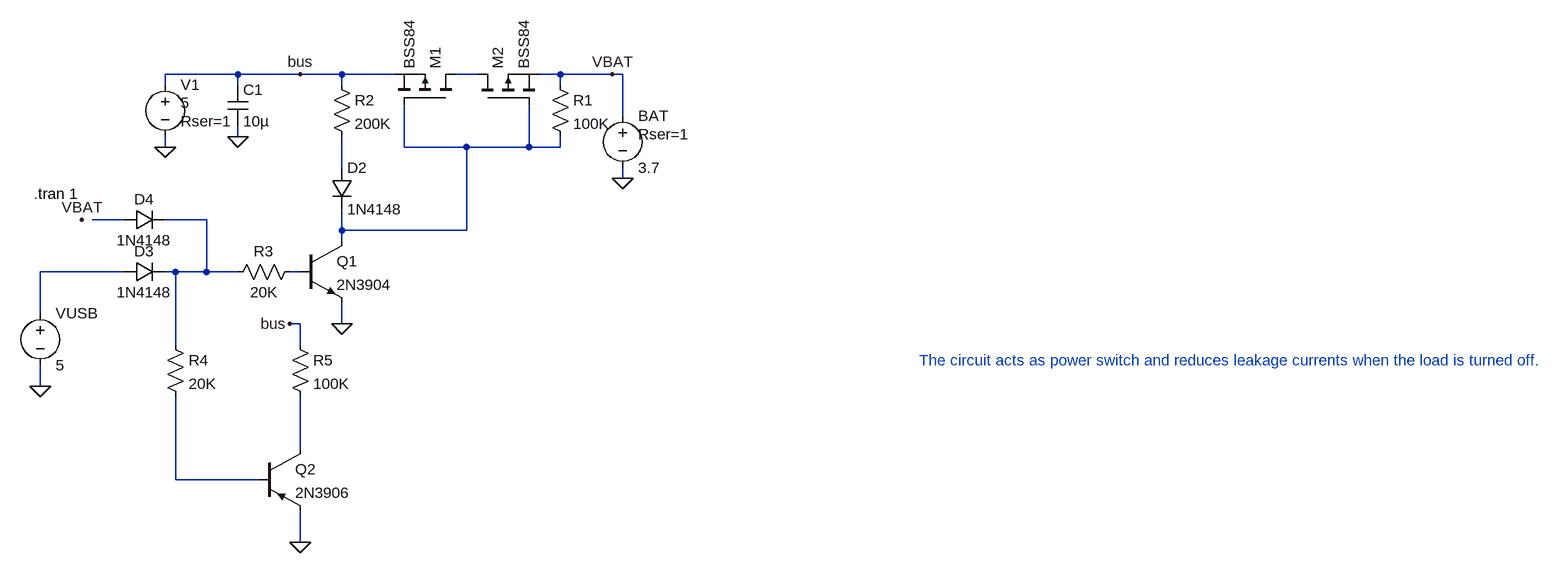
[diagram p0: schematic Batteryswitch.asc]
Batteryswitch.asc, the LTspice schematic file:
Version 4
SHEET 1 1956 680
WIRE -144 -848 -256 -848
WIRE -48 -848 -144 -848
WIRE 16 -848 -48 -848
WIRE 96 -848 16 -848
WIRE 224 -848 192 -848
WIRE 352 -848 320 -848
WIRE 432 -848 352 -848
WIRE 448 -848 432 -848
WIRE -256 -832 -256 -848
WIRE -144 -832 -144 -848
WIRE 16 -832 16 -848
WIRE 352 -832 352 -848
WIRE 448 -784 448 -848
WIRE -144 -752 -144 -768
WIRE -256 -736 -256 -752
WIRE 112 -736 112 -800
WIRE 208 -736 112 -736
WIRE 304 -736 304 -800
WIRE 304 -736 208 -736
WIRE 352 -736 352 -752
WIRE 352 -736 304 -736
WIRE 16 -704 16 -752
WIRE 448 -688 448 -704
WIRE -320 -624 -368 -624
WIRE -192 -624 -256 -624
WIRE 16 -608 16 -640
WIRE 208 -608 208 -736
WIRE 208 -608 16 -608
WIRE 16 -592 16 -608
WIRE -320 -544 -448 -544
WIRE -240 -544 -256 -544
WIRE -192 -544 -192 -624
WIRE -192 -544 -240 -544
WIRE -144 -544 -192 -544
WIRE -48 -544 -64 -544
WIRE -448 -480 -448 -544
WIRE -48 -464 -64 -464
WIRE 16 -464 16 -496
WIRE -240 -432 -240 -544
WIRE -48 -432 -48 -464
WIRE -448 -368 -448 -400
WIRE -48 -272 -48 -352
WIRE -240 -224 -240 -352
WIRE -112 -224 -240 -224
WIRE -48 -128 -48 -176
FLAG -256 -736 0
FLAG 448 -688 0
FLAG 16 -464 0
FLAG -448 -368 0
FLAG -144 -752 0
FLAG 432 -848 VBAT
FLAG -384 -624 VBAT
FLAG -48 -848 bus
FLAG -64 -464 bus
FLAG -48 -128 0
SYMBOL pmos 192 -800 M270
SYMATTR InstName M1
SYMATTR Value BSS84
SYMBOL voltage -256 -848 R0
WINDOW 3 24 44 Left 2
WINDOW 123 0 0 Left 0
WINDOW 39 24 72 Left 2
SYMATTR InstName V1
SYMATTR Value 5
SYMATTR SpiceLine Rser=1
SYMBOL voltage 448 -800 R0
WINDOW 123 0 0 Left 0
WINDOW 39 24 44 Left 2
SYMATTR InstName BAT
SYMATTR Value 3.7
SYMATTR SpiceLine Rser=1
SYMBOL pmos 224 -800 R270
SYMATTR InstName M2
SYMATTR Value BSS84
SYMBOL res 336 -848 R0
SYMATTR InstName R1
SYMATTR Value 100K
SYMBOL npn -48 -592 R0
SYMATTR InstName Q1
SYMATTR Value 2N3904
SYMBOL res 0 -848 R0
SYMATTR InstName R2
SYMATTR Value 200K
SYMBOL res -48 -560 R90
WINDOW 0 0 56 VBottom 2
WINDOW 3 32 56 VTop 2
SYMATTR InstName R3
SYMATTR Value 20K
SYMBOL diode 0 -704 R0
SYMATTR InstName D2
SYMATTR Value 1N4148
SYMBOL voltage -448 -496 R0
WINDOW 123 0 0 Left 0
WINDOW 39 0 0 Left 0
SYMATTR InstName VUSB
SYMATTR Value 5
SYMBOL cap -160 -832 R0
SYMATTR InstName C1
SYMATTR Value 10µ
SYMBOL diode -320 -528 R270
WINDOW 0 32 32 VTop 2
WINDOW 3 0 32 VBottom 2
SYMATTR InstName D3
SYMATTR Value 1N4148
SYMBOL diode -320 -608 R270
WINDOW 0 32 32 VTop 2
WINDOW 3 0 32 VBottom 2
SYMATTR InstName D4
SYMATTR Value 1N4148
SYMBOL pnp -112 -272 R0
SYMATTR InstName Q2
SYMATTR Value 2N3906
SYMBOL res -256 -448 R0
SYMATTR InstName R4
SYMATTR Value 20K
SYMBOL res -64 -448 R0
SYMATTR InstName R5
SYMATTR Value 100K
TEXT -458 -664 Left 2 !.tran 1
TEXT 904 -408 Left 2 ;The circuit acts as power switch and reduces leakage currents when the load is turned off.

The netlist it stands for:
* Batteryswitch.asc
M1 N001 N002 bus bus BSS84
V1 bus 0 5 Rser=1
V§BAT VBAT 0 3.7 Rser=1
M2 N001 N002 VBAT VBAT BSS84
R1 VBAT N002 100K
Q1 N002 N007 0 0 2N3904
R2 bus N003 200K
R3 N007 N005 20K
D2 N003 N002 1N4148
VUSB N006 0 5
C1 bus 0 10µ
D3 N006 N005 1N4148
D4 N004 N005 1N4148
Q2 N008 N009 0 0 2N3906
R4 N005 N009 20K
R5 bus N008 100K
.model D D
.lib standard.dio
.model NPN NPN
.model PNP PNP
.lib standard.bjt
.model NMOS NMOS
.model PMOS PMOS
.lib standard.mos
.tran 1
* The circuit acts as power switch and reduces leakage currents when the load is turned off.
.backanno
.end